# Altium schematic sheet PWR.SchDoc
size A4
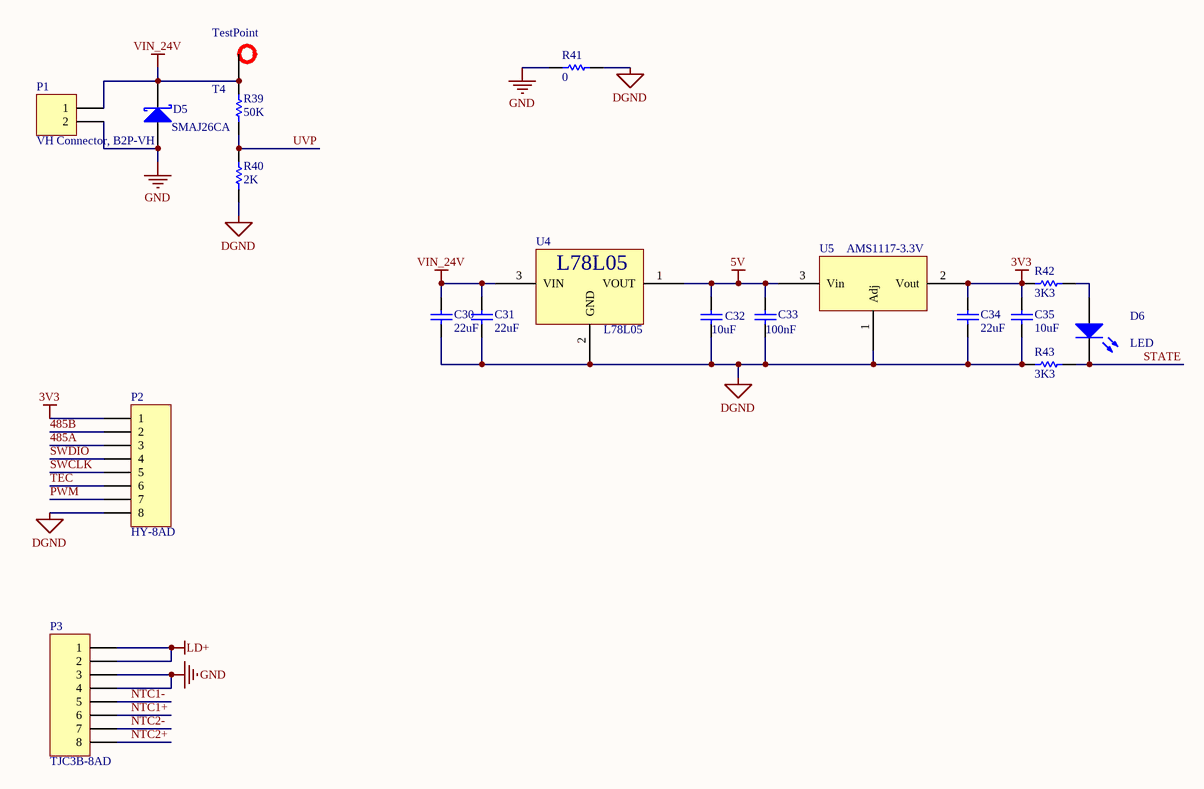
[diagram p0: PWR.SchDoc]

## Parts
C30  22uF  [1608[0603]]
C31  22uF  [1608[0603]]
C32  10uF  [1608[0603]]
C33  100nF  [1608[0603]]
C34  22uF  [1608[0603]]
C35  10uF  [1608[0603]]
D5  SMAJ26CA  [SMA_DIOM5226X26N]
D6  LED  [2012[0805] - LED]
P1  VH Connector, B2P-VH  [2PIN-B2P_VH]
P2  HY-8AD  [8P -HY-8AD]
P3  TJC3B-8AD  [8P-TJC3B8AD]
R39  50K  [1608[0603]]
R40  2K  [1608[0603]]
R41  0  [2012[0805]]
R42  3K3  [1608[0603]]
R43  3K3  [1608[0603]]
T4  Test Point  [TestPoint]  (value not drawn)
U4  L78L05  [SOT89-150P410X160-3N]
U5  AMS1117-3.3V  [SOT89-150P410X160-3N]

## Nets
3V3: C34.2 C35.2 P2.1 R42.2 U5.2(Vout)
5V: C32.2 C33.2 U4.1(VOUT) U5.3(Vin)
DGND: C30.1 C31.1 C32.1 C33.1 C34.1 C35.1 P2.8 R40.2 R41.1 R43.2 U4.2(GND) U5.1(Adj)
GND: D5.1(A) P1.2 P3.3 P3.4 R41.2
LD+: P3.1 P3.2
VIN_24V: C30.2 C31.2 D5.2(K) P1.1 R39.1 T4.1(TP) U4.3(VIN)
485A: P2.3
485B: P2.2
NTC1+: P3.6
NTC1-: P3.5
NTC2+: P3.8
NTC2-: P3.7
PWM: P2.7
STATE: D6.2(K) R43.1
SWCLK: P2.5
SWDIO: P2.4
TEC: P2.6
UVP: R39.2 R40.1
NetD6_1: D6.1(A) R42.1

## Notes on the sheet
- (in symbol TP) TestPoint

## Library data of the parts
C30-C35 = Cap: Capacitor; Published: 8-Jun-2000; LatestRevisionDate: 17-Jul-2002; LatestRevisionNote: Re-released for DXP Platform.; PackageReference: RAD-0.3; Publisher: Altium Limited; PackageDescription: Radial Cap, Thru-Hole; 2 Leads; 0.3 in Pin Spacing
  C30 C31 C34: Value: 22uF
  C32 C35: Value: 10uF
  C33: Value: 100nF
D5 = D Schottky: Schottky Diode; Published: 8-Jun-2000; LatestRevisionDate: 17-Jul-2002; LatestRevisionNote: Re-released for DXP Platform.; PackageReference: SMB; Publisher: Altium Limited; PackageDescription: DO-214-AA/SMB; 2 C-Bend Leads; Body 5.3 x 3.6 mm, inc. leads (LxW); Code_JEDEC: DO-214-AA
D6 = LED0: Typical INFRARED GaAs LED; Published: 8-Jun-2000; LatestRevisionDate: 08-Jul-2005; LatestRevisionNote: Mech Layer 1 removed.; PackageReference: LED-0; Publisher: Altium Limited; PackageDescription: LED; 2 Leads
P1 = Header 2: Header, 2-Pin; LatestRevisionDate: 17-Jul-2002; LatestRevisionNote: Re-released for DXP Platform.; Publisher: Altium Limited
P2 P3 = Header 8: Header, 8-Pin; LatestRevisionDate: 17-Jul-2002; LatestRevisionNote: Re-released for DXP Platform.; Publisher: Altium Limited
R39-R43 = Res1: Resistor; Published: 8-Jun-2000; LatestRevisionDate: 17-Jul-2002; LatestRevisionNote: Re-released for DXP Platform.; PackageReference: AXIAL-0.3; Publisher: Altium Limited; PackageDescription: Axial Device, Thru-Hole; 2 Leads; 0.3 in Pin Spacing
  R39: Value: 50k
  R40: Value: 2K
  R41: Value: 0
  R42 R43: Value: 3K3
T4 = TP
U4 = PWR_L78L05: POSITIVE VOLTAGE REGULATORS
U5 = PWR_LM1XXX: 5V转3V3 10mA  DC/DC